# Altium schematic sheet Schematic.SchDoc
size A3; SheetNumber: 1; SheetTotal: 1
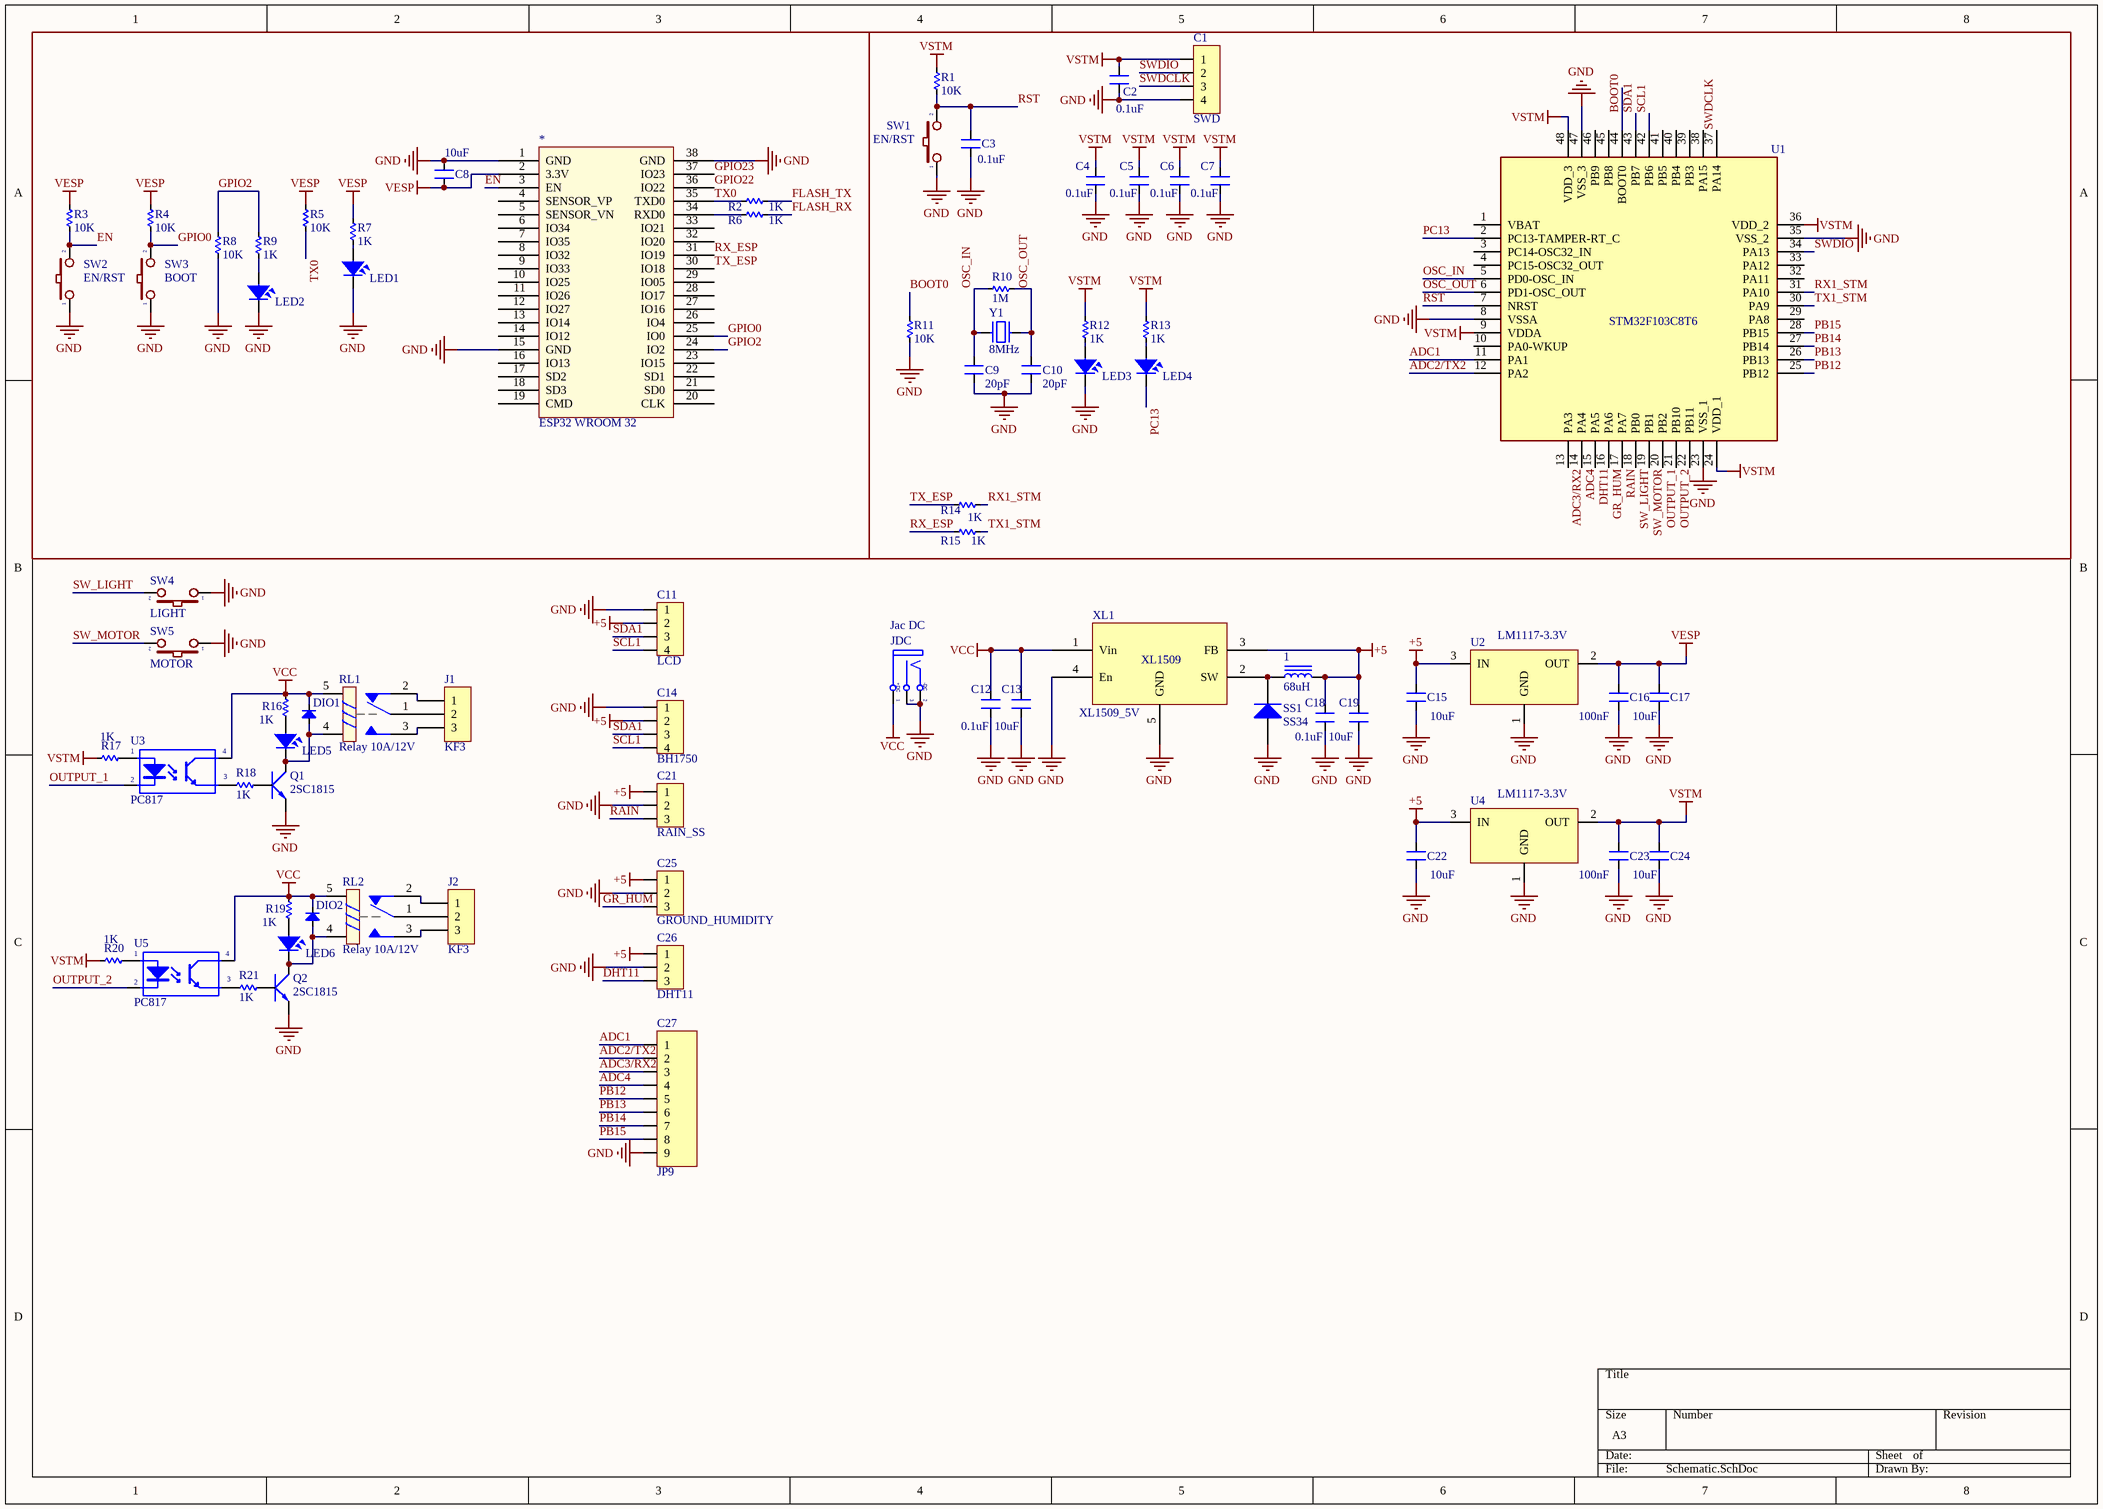
[diagram p0: Schematic.SchDoc]

## Parts
1  68uH  [CDRH104R]
*  ESP32 WROOM 32  [ESP32-WROOM-32D]
C1  SWD  [JP4-C1T]
C2  0.1uF  [SM-0805]
C3  0.1uF  [SM-0805]
C4  0.1uF  [SM-0805]
C5  0.1uF  [SM-0805]
C6  0.1uF  [SM-0805]
C7  0.1uF  [SM-0805]
C8  10uF  [SM-0805]
C9  20pF  [SM-0805]
C10  20pF  [SM-0805]
C11  LCD  [Header4]
C12  0.1uF  [SM-0805]
C13  10uF  [SM-0805]
C14  BH1750  [Header4]
C15  10uF  [SM-0805]
C16  100nF  [SM-0805]
C17  10uF  [SM-0805]
C18  0.1uF  [SM-0805]
C19  10uF  [SM-0805]
C21  RAIN_SS  [Header3]
C22  10uF  [SM-0805]
C23  100nF  [SM-0805]
C24  10uF  [SM-0805]
C25  GROUND_HUMIDITY  [Header3]
C26  DHT11  [Header3]
C27  JP9  [JP9-C1T]
DIO1  Diode SMD  [DIO-SMD-A]  (value not drawn)
DIO2  Diode SMD  [DIO-SMD-A]  (value not drawn)
J1  KF3  [KF3_5.08_1]
J2  KF3  [KF3_5.08_1]
JDC  Jac DC  [DC0]
LED1  LED  [LED-0805-Green]  (value not drawn)
LED2  LED  [LED-0805-Green]  (value not drawn)
LED3  LED  [LED-0805-Green]  (value not drawn)
LED4  LED  [LED-0805-Green]  (value not drawn)
LED5  LED  [LED-0805-Green]  (value not drawn)
LED6  LED  [LED-0805-Green]  (value not drawn)
Q1  2SC1815  [SOT23-321]
Q2  2SC1815  [SOT23-321]
R1  10K  [RES-SMD-0805]
R2  1K  [RES-SMD-0805]
R3  10K  [RES-SMD-0805]
R4  10K  [RES-SMD-0805]
R5  10K  [RES-SMD-0805]
R6  1K  [RES-SMD-0805]
R7  1K  [RES-SMD-0805]
R8  10K  [RES-SMD-0805]
R9  1K  [RES-SMD-0805]
R10  1M  [RES-SMD-0805]
R11  10K  [RES-SMD-0805]
R12  1K  [RES-SMD-0805]
R13  1K  [RES-SMD-0805]
R14  1K  [RES-SMD-0805]
R15  1K  [RES-SMD-0805]
R16  1K  [RES-SMD-0805]
R17  1K  [RES-SMD-0805]
R18  1K  [RES-SMD-0805]
R19  1K  [RES-SMD-0805]
R20  1K  [RES-SMD-0805]
R21  1K  [RES-SMD-0805]
RL1  Relay 10A/12V  [RELAY 5]
RL2  Relay 10A/12V  [RELAY 5]
SS1  SS34  [DIODE SMA]
SW1  EN/RST  [SW1-SMD]
SW2  EN/RST  [SW1-SMD]
SW3  BOOT  [SW1-SMD]
SW4  LIGHT  [SW1-SMD]
SW5  MOTOR  [SW1-SMD]
U1  STM32F103C8T6  [LQFP-48_19.6_393_58X11_SMD]
U2  LM1117-3.3V  [SOT223]
U3  PC817  [PC817_SMD]
U4  LM1117-3.3V  [SOT223]
U5  PC817  [PC817_SMD]
XL1  XL1509_5V  [SO8]
Y1  8MHz  [Thach Anh 2 chan SMD]

## Nets
+5: 1.2 C11.2 C14.2 C15.2 C18.1 C19.1 C21.1 C22.2 C25.1 C26.1 U2.3(IN) U4.3(IN) XL1.3(FB)
GND: *.1(GND) *.15(GND) *.38(GND) C1.4 C2.2 C3.1 C4.2 C5.2 C6.2 C7.2 C8.2 C9.2 C10.2 C11.1 C12.2 C13.2 C14.1 C15.1 C16.1 C17.1 C18.2 C19.2 C21.2 C22.1 C23.1 C24.1 C25.2 C26.2 C27.9 JDC.2(TN) JDC.3(S) LED1.2 LED2.2 LED3.2 Q1.1(E) Q2.1(E) R8.2 R11.2 SS1.1(A) SW1.1 SW2.1 SW3.1 SW4.1 SW5.1 U1.8(VSSA) U1.23(VSS_1) U1.35(VSS_2) U1.47(VSS_3) U2.1(GND) U4.1(GND) XL1.4(En) XL1.5(GND)
VCC: C12.1 C13.1 DIO1.2(K) DIO2.2(K) JDC.1(T) R16.1 R19.1 RL1.5 RL2.5 U3.4(C) U5.4(C) XL1.1(Vin)
VESP: *.2(3.3V) C8.1 C16.2 C17.2 R3.1 R4.1 R5.1 R7.1 U2.2(OUT)
VSTM: C1.1 C2.1 C4.1 C5.1 C6.1 C7.1 C23.2 C24.2 R1.1 R12.1 R13.1 R17.2 R20.2 U1.9(VDDA) U1.24(VDD_1) U1.36(VDD_2) U1.48(VDD_3) U4.2(OUT)
ADC1: C27.1 U1.11(PA1)
ADC2/TX2: C27.2 U1.12(PA2)
ADC3/RX2: C27.3 U1.13(PA3)
ADC4: C27.4 U1.14(PA4)
BOOT0: R11.1 U1.44(BOOT0)
DHT11: C26.3 U1.15(PA5)
EN: *.3(EN) R3.2 SW2.2
FLASH_RX: R6.1
FLASH_TX: R2.1
GPIO0: *.25(IO0) R4.2 SW3.2
GPIO2: *.24(IO2) R8.1 R9.1
GPIO22: *.36(IO22)
GPIO23: *.37(IO23)
GR_HUM: C25.3 U1.16(PA6)
OSC_IN: C9.1 R10.1 U1.5(PD0-OSC_IN) Y1.2
OSC_OUT: C10.1 R10.2 U1.6(PD1-OSC_OUT) Y1.1
OUTPUT_1: U1.20(PB2) U3.2(K)
OUTPUT_2: U1.21(PB10) U5.2(K)
PB12: C27.5 U1.25(PB12)
PB13: C27.6 U1.26(PB13)
PB14: C27.7 U1.27(PB14)
PB15: C27.8 U1.28(PB15)
PC13: LED4.2 U1.2(PC13-TAMPER-RT_C)
RAIN: C21.3 U1.17(PA7)
RST: C3.2 R1.2 SW1.2 U1.7(NRST)
RX1_STM: R14.2 U1.31(PA10)
RX_ESP: *.31(IO19) R15.1
SCL1: C11.4 C14.4 U1.42(PB6)
SDA1: C11.3 C14.3 U1.43(PB7)
SW_LIGHT: SW4.2 U1.18(PB0)
SW_MOTOR: SW5.2 U1.19(PB1)
SWDCLK: C1.3 U1.37(PA14)
SWDIO: C1.2 U1.34(PA13)
TX0: *.35(TXD0) R2.2 R5.2
TX1_STM: R15.2 U1.30(PA9)
TX_ESP: *.30(IO18) R14.1
Net1_1: 1.1 SS1.2(K) XL1.2(SW)
Net*_34: *.34(RXD0) R6.2
NetDIO1_1: DIO1.1(A) LED5.2 Q1.2(C) RL1.4
NetDIO2_1: DIO2.1(A) LED6.2 Q2.2(C) RL2.4
NetJ1_1: J1.1 RL1.2
NetJ1_2: J1.2 RL1.1
NetJ1_3: J1.3 RL1.3
NetJ2_1: J2.1 RL2.2
NetJ2_2: J2.2 RL2.1
NetJ2_3: J2.3 RL2.3
NetLED1_1: LED1.1 R7.2
NetLED2_1: LED2.1 R9.2
NetLED3_1: LED3.1 R12.2
NetLED4_1: LED4.1 R13.2
NetLED5_1: LED5.1 R16.2
NetLED6_1: LED6.1 R19.2
NetQ1_3: Q1.3(B) R18.2
NetQ2_3: Q2.3(B) R21.2
NetR17_1: R17.1 U3.1(A)
NetR18_1: R18.1 U3.3(E)
NetR20_1: R20.1 U5.1(A)
NetR21_1: R21.1 U5.3(E)

Not connected (* = marked no-connect by the designer): * 4(SENSOR_VP) 5(SENSOR_VN) 6(IO34) 7(IO35) 8(IO32) 9(IO33) 10(IO25) 11(IO26) 12(IO27) 13(IO14) 14(IO12) 16(IO13) 17(SD2) 18(SD3) 19(CMD) 20(CLK) 21(SD0) 22(SD1) 23(IO15) 26(IO4) 27(IO16) 28(IO17) 29(IO05) 32(IO20) 33(IO21); U1 1(VBAT) 3(PC14-OSC32_IN) 4(PC15-OSC32_OUT) 10(PA0-WKUP) 22(PB11) 29(PA8) 32(PA11) 33(PA12) 38(PA15) 39(PB3) 40(PB4) 41(PB5) 45(PB8) 46(PB9)

## Notes on the sheet
- (in symbol DCIN) +DC; -DC

## Library data of the parts
1 = Inductor: SMT Inductor; Value: 1.5uH
C1 = JP4: WR-PHD 2.54 mm Angled Socket Header; Manufacturer: W¨¹rth Elektronik eiSos GmbH; partNo: 613004143121; ComponentLink1 Description: Manufacturer; ComponentLink2 Description: Datasheet; NoPins: 04; Created Date: 29 March 2013; ComponentLink1URL: http://www.we-online.com; ComponentLink2URL: http://katalog.we-online.de/em/datasheet/6130xx143121.pdf; Created by: Karrer Zheng
C2-C10 C12 C13 C15-C19 C22-C24 = CM: Cap SMD; Value: 103
C11 C14 = Header4: Header IDC, 4 x 1 Pin Vertical 2.54mm Pitch (Non-Boxed, Male); Manufacturer: W¨¹rth Elektronik eiSos GmbH; partNo: 613002143121; ComponentLink1 Description: Manufacturer; ComponentLink2 Description: Datasheet; NoPins: 02; Created Date: 29 March 2013; ComponentLink1URL: http://www.we-online.com; ComponentLink2URL: http://katalog.we-online.de/em/datasheet/6130xx143121.pdf; Created by: Karrer Zheng
C21 C25 C26 = Header3: Header IDC, 3 x 1 Pin Vertical 2.54mm Pitch (Non-Boxed, Male); Manufacturer: W¨¹rth Elektronik eiSos GmbH; partNo: 613002143121; ComponentLink1 Description: Manufacturer; ComponentLink2 Description: Datasheet; NoPins: 02; Created Date: 29 March 2013; ComponentLink1URL: http://www.we-online.com; ComponentLink2URL: http://katalog.we-online.de/em/datasheet/6130xx143121.pdf; Created by: Karrer Zheng
C27 = JP9: WR-PHD 2.54 mm Angled Socket Header; Manufacturer: W¨¹rth Elektronik eiSos GmbH; partNo: 613009143121; ComponentLink1 Description: Manufacturer; ComponentLink2 Description: Datasheet; NoPins: 09; Created Date: 29 March 2013; ComponentLink1URL: http://www.we-online.com; ComponentLink2URL: http://katalog.we-online.de/em/datasheet/6130xx143121.pdf; Created by: Karrer Zheng
DIO1 DIO2 = Diode SMD: Default Diode; Code - JEDEC: DO-214-AB; Value: 1N5007; Published: 8-Jun-2000; Revision: July-2002: Re-released for DXP Platform.; Publisher: Altium Limited
J1 J2 = KF3: Manufacturer: Würth Elektronik eiSos GmbH; partNo: 691103110003; ComponentLink1 Description: Manufacturer; ComponentLink2 Description: Datasheet; NoPins: 3; Created Date: 29 October 2013; ComponentLink1URL: http://www.we-online.com; ComponentLink2URL: http://katalog.we-online.de/em/datasheet/6911031100xx.pdf; Created by: Karrer Zheng
JDC = DCIN: Jac DC input; Value: Jac DC
LED1-LED6 = LED SMD: Value: LED 3 - 5 ly 2 Colour
Q1 Q2 = 2SC1815: NPN 600mW, ECB; Value: C1815
R1-R21 = Res-SMD: Resistor; Manufacturer: Generic Components; Class: Passive; Published: 08/06/2000; Publisher: Altium Hobart Technology Centre
RL1 RL2 = Relay 5: Relay SPDT,10A - 12VDC 5 Pin; Value: Relay SPDT, 10A, 12V
SS1 = Diode SS34 ( 1N5822 ): Dán; Don_Vi: Con; Ma_Hang: MH002104; Ten_Linh_Kien: Diode SS34 3A 40V SMA ( 1N5822 SS34A); Kieu_Chan: *; Chung_Loai: Dán
SW1-SW5 = SW2: Switch button 2 pin; Value: SW chip 2 pin
U1 = IC_STM32F103C8T6: ARM® Cortex®-M3 STM32F1 Microcontroller IC 32-Bit 72MHz 64KB (64K x 8) FLASH 48-LQFP (7x7) /; Manufacturer: STMicroelectronics; Alternate Part Number-1: NA; Manufacturer Part Number: STM32F103C8T6; Case/Package: LQFP48; Supplier-1: LCSC; Supplier Part Number-1: STM32F103C8T6
U2 U4 = LM1117: 800mA Low-Dropout Linear Regulator; Creator: Nguyen Ba Bien; Website: http://group3i.net
U3 U5 = PC817: Single Opto; Value: PC817
XL1 = XL1509: pin to pad: 5>5+6+7+8
Y1 = Thach Anh 2 chan SMD: Crystal For all Crystal 2pin.; Value: 4Mhz